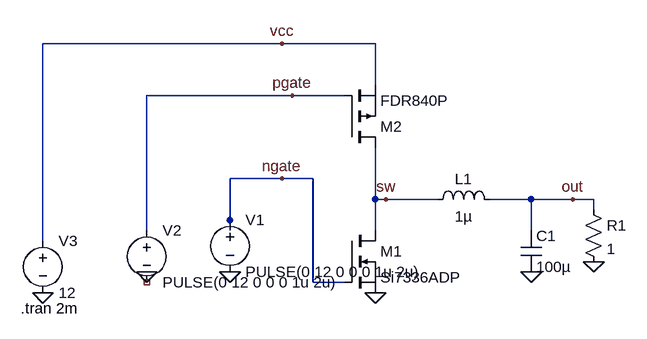
[diagram p0: schematic Draft1.asc]
Draft1.asc, the LTspice schematic file:
Version 4
SHEET 1 880 680
WIRE 32 -192 -336 -192
WIRE 176 -192 32 -192
WIRE 176 -128 176 -192
WIRE 48 -112 -176 -112
WIRE 128 -112 48 -112
WIRE 32 16 -48 16
WIRE 80 16 32 16
WIRE 176 48 176 -32
WIRE 192 48 176 48
WIRE 272 48 192 48
WIRE 416 48 352 48
WIRE 480 48 416 48
WIRE 512 48 480 48
WIRE 512 64 512 48
WIRE -48 80 -48 16
WIRE -176 96 -176 -112
WIRE -48 96 -48 80
WIRE 176 96 176 48
WIRE 416 96 416 48
WIRE -336 112 -336 -192
WIRE 80 176 80 16
WIRE 128 176 80 176
FLAG -48 160 0
FLAG -176 160 0
FLAG -336 192 0
FLAG 416 160 0
FLAG 512 144 0
FLAG 480 48 out
FLAG 192 48 sw
FLAG 48 -112 pgate
FLAG 32 16 ngate
FLAG 32 -192 vcc
FLAG 176 192 0
SYMBOL nmos 128 96 R0
SYMATTR InstName M1
SYMATTR Value Si7336ADP
SYMBOL pmos 128 -32 M180
SYMATTR InstName M2
SYMATTR Value FDR840P
SYMBOL voltage -48 64 R0
WINDOW 123 0 0 Left 0
WINDOW 39 0 0 Left 0
SYMATTR InstName V1
SYMATTR Value PULSE(0 12 0 0 0 1u 2u)
SYMBOL voltage -336 96 R0
WINDOW 123 0 0 Left 0
WINDOW 39 0 0 Left 0
SYMATTR InstName V3
SYMATTR Value 12
SYMBOL ind 256 64 R270
WINDOW 0 32 56 VTop 2
WINDOW 3 5 56 VBottom 2
SYMATTR InstName L1
SYMATTR Value 1µ
SYMBOL cap 400 96 R0
SYMATTR InstName C1
SYMATTR Value 100µ
SYMBOL res 496 48 R0
SYMATTR InstName R1
SYMATTR Value 1
SYMBOL voltage -176 80 R0
WINDOW 123 0 0 Left 0
WINDOW 39 0 0 Left 0
SYMATTR InstName V2
SYMATTR Value PULSE(0 12 0 0 0 1u 2u)
TEXT -370 216 Left 2 !.tran 2m

The netlist it stands for:
* Draft1.asc
M1 sw ngate 0 0 Si7336ADP
M2 sw pgate vcc vcc FDR840P
V1 ngate 0 PULSE(0 12 0 0 0 1u 2u)
V3 vcc 0 12
L1 sw out 1µ
C1 out 0 100µ
R1 out 0 1
V2 pgate NC_01 PULSE(0 12 0 0 0 1u 2u)
.model NMOS NMOS
.model PMOS PMOS
.lib standard.mos
.tran 2m
.backanno
.end